# EAGLE design encoder_amplifier2_1layer (EAGLE 7.6.0)
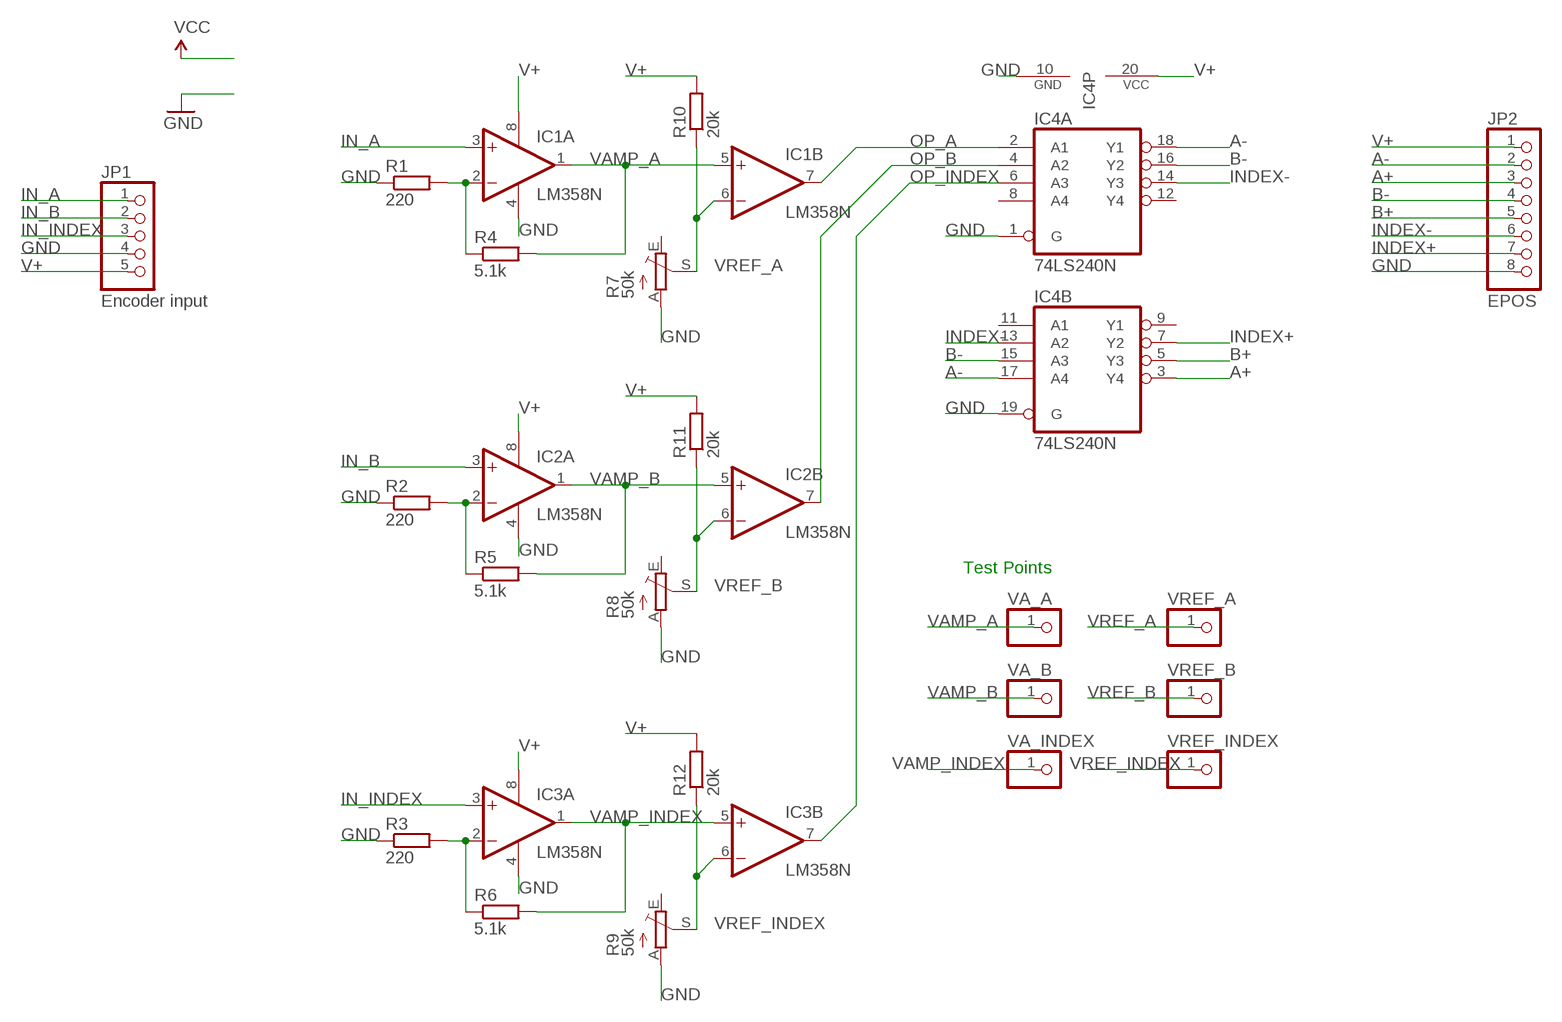
[diagram p0: schematic, sheet 1]

## Parts
IC1  LM358N  [DIL08]
IC2  LM358N  [DIL08]
IC3  LM358N  [DIL08]
IC4  74LS240N  [DIL20]
JP1  Encoder input  PINHD-1X5  [1X05]
JP2  EPOS  PINHD-1X8  [1X08]
R1  220  R-EU_0204/7  [0204/7]
R2  220  R-EU_0204/7  [0204/7]
R3  220  R-EU_0204/7  [0204/7]
R4  5.1k  R-EU_0204/7  [0204/7]
R5  5.1k  R-EU_0204/7  [0204/7]
R6  5.1k  R-EU_0204/7  [0204/7]
R7  50k  TRIM_EU-LI15  [LI15]
R8  50k  TRIM_EU-LI15  [LI15]
R9  50k  TRIM_EU-LI15  [LI15]
R10  20k  R-EU_0204/7  [0204/7]
R11  20k  R-EU_0204/7  [0204/7]
R12  20k  R-EU_0204/7  [0204/7]
VA_A  PINHD-1X1  [1X01]
VA_B  PINHD-1X1  [1X01]
VA_INDEX  PINHD-1X1  [1X01]
VREF_A  PINHD-1X1  [1X01]
VREF_B  PINHD-1X1  [1X01]
VREF_INDEX  PINHD-1X1  [1X01]

## Nets
A+: IC4.3(B:Y4) JP2.3
A-: IC4.17(B:A4) IC4.18(A:Y1) JP2.2
B+: IC4.5(B:Y3) JP2.5
B-: IC4.15(B:A3) IC4.16(A:Y2) JP2.4
GND: IC1.4(P:V-) IC2.4(P:V-) IC3.4(P:V-) IC4.1(A:G) IC4.10(P:GND) IC4.19(B:G) JP1.4 JP2.8 R1.1 R2.1 R3.1 R7.A R8.A R9.A
IN_A: IC1.3(A:+IN) JP1.1
IN_B: IC2.3(A:+IN) JP1.2
IN_INDEX: IC3.3(A:+IN) JP1.3
INDEX+: IC4.7(B:Y2) JP2.7
INDEX-: IC4.13(B:A2) IC4.14(A:Y3) JP2.6
N$1: IC1.2(A:-IN) R1.2 R4.1
N$2: IC2.2(A:-IN) R2.2 R5.1
N$3: IC3.2(A:-IN) R3.2 R6.1
OP_A: IC1.7(B:OUT) IC4.2(A:A1)
OP_B: IC2.7(B:OUT) IC4.4(A:A2)
OP_INDEX: IC3.7(B:OUT) IC4.6(A:A3)
V+: IC1.8(P:V+) IC2.8(P:V+) IC3.8(P:V+) IC4.20(P:VCC) JP1.5 JP2.1 R10.2 R11.2 R12.2 ; supply symbol labelled VCC
VAMP_A: IC1.1(A:OUT) IC1.5(B:+IN) R4.2 VA_A.1
VAMP_B: IC2.1(A:OUT) IC2.5(B:+IN) R5.2 VA_B.1
VAMP_INDEX: IC3.1(A:OUT) IC3.5(B:+IN) R6.2 VA_INDEX.1
VREF_A: IC1.6(B:-IN) R7.S R10.1 VREF_A.1
VREF_B: IC2.6(B:-IN) R8.S R11.1 VREF_B.1
VREF_INDEX: IC3.6(B:-IN) R9.S R12.1 VREF_INDEX.1
Unconnected: IC4.8(A:A4) IC4.9(B:Y1) IC4.11(B:A1) IC4.12(A:Y4) R7.E R8.E R9.E

## Notes on the sheet
- Test Points

## Library data of the parts
IC1-IC3 = linear:LM358: OP AMP also LM158; LM258; LM2904 Source: http://cache.national.com/ds/LM/LM158.pdf
IC4 = 74xx-us:74*240: Octal BUFFER and LINE DRIVER, 3-state
JP1 = pinhead:PINHD-1X5: PIN HEADER
JP2 = pinhead:PINHD-1X8: PIN HEADER
R1-R6 R10-R12 = resistor:R-EU_: RESISTOR, European symbol
R7-R9 = pot:TRIM_EU-: POTENTIOMETER
VA_A VA_B VA_INDEX VREF_A VREF_B VREF_INDEX = pinhead:PINHD-1X1: PIN HEADER

## Net classes
0 default: width 0.61 mm, drill 0.61 mm, clearance 0.61 mm

## Board
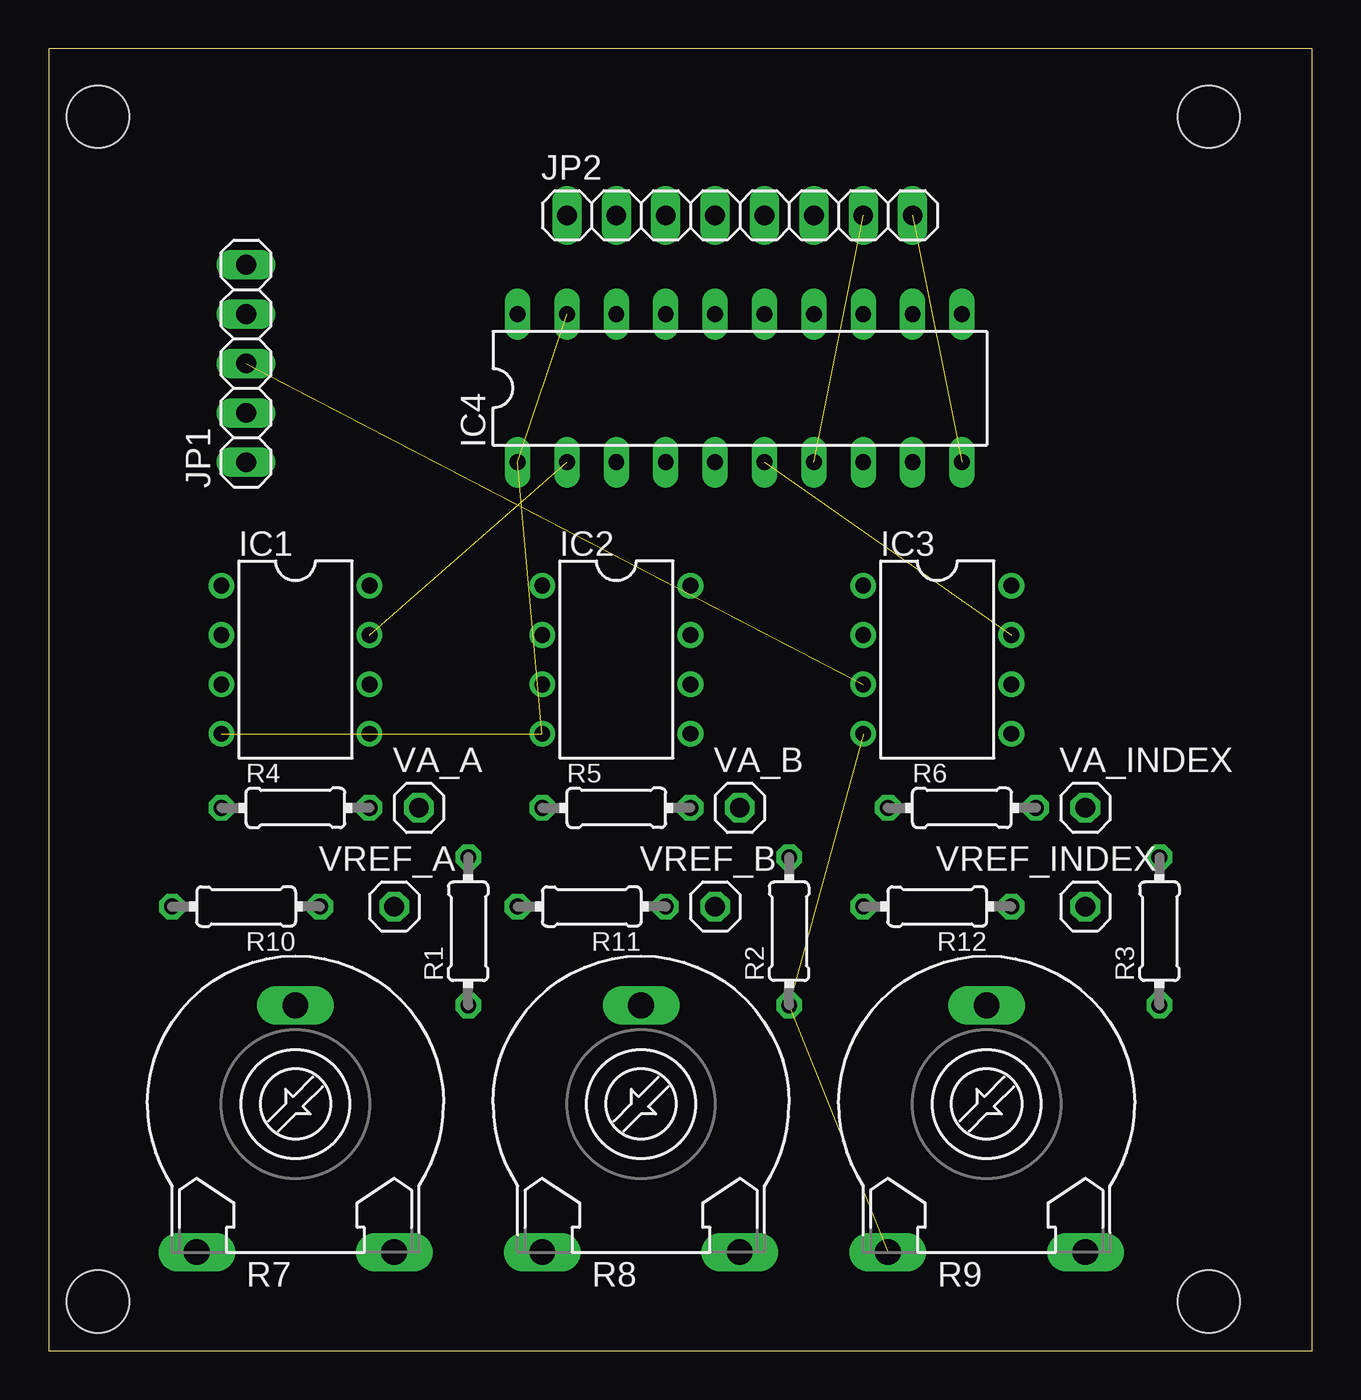
[diagram p1: board, top side]
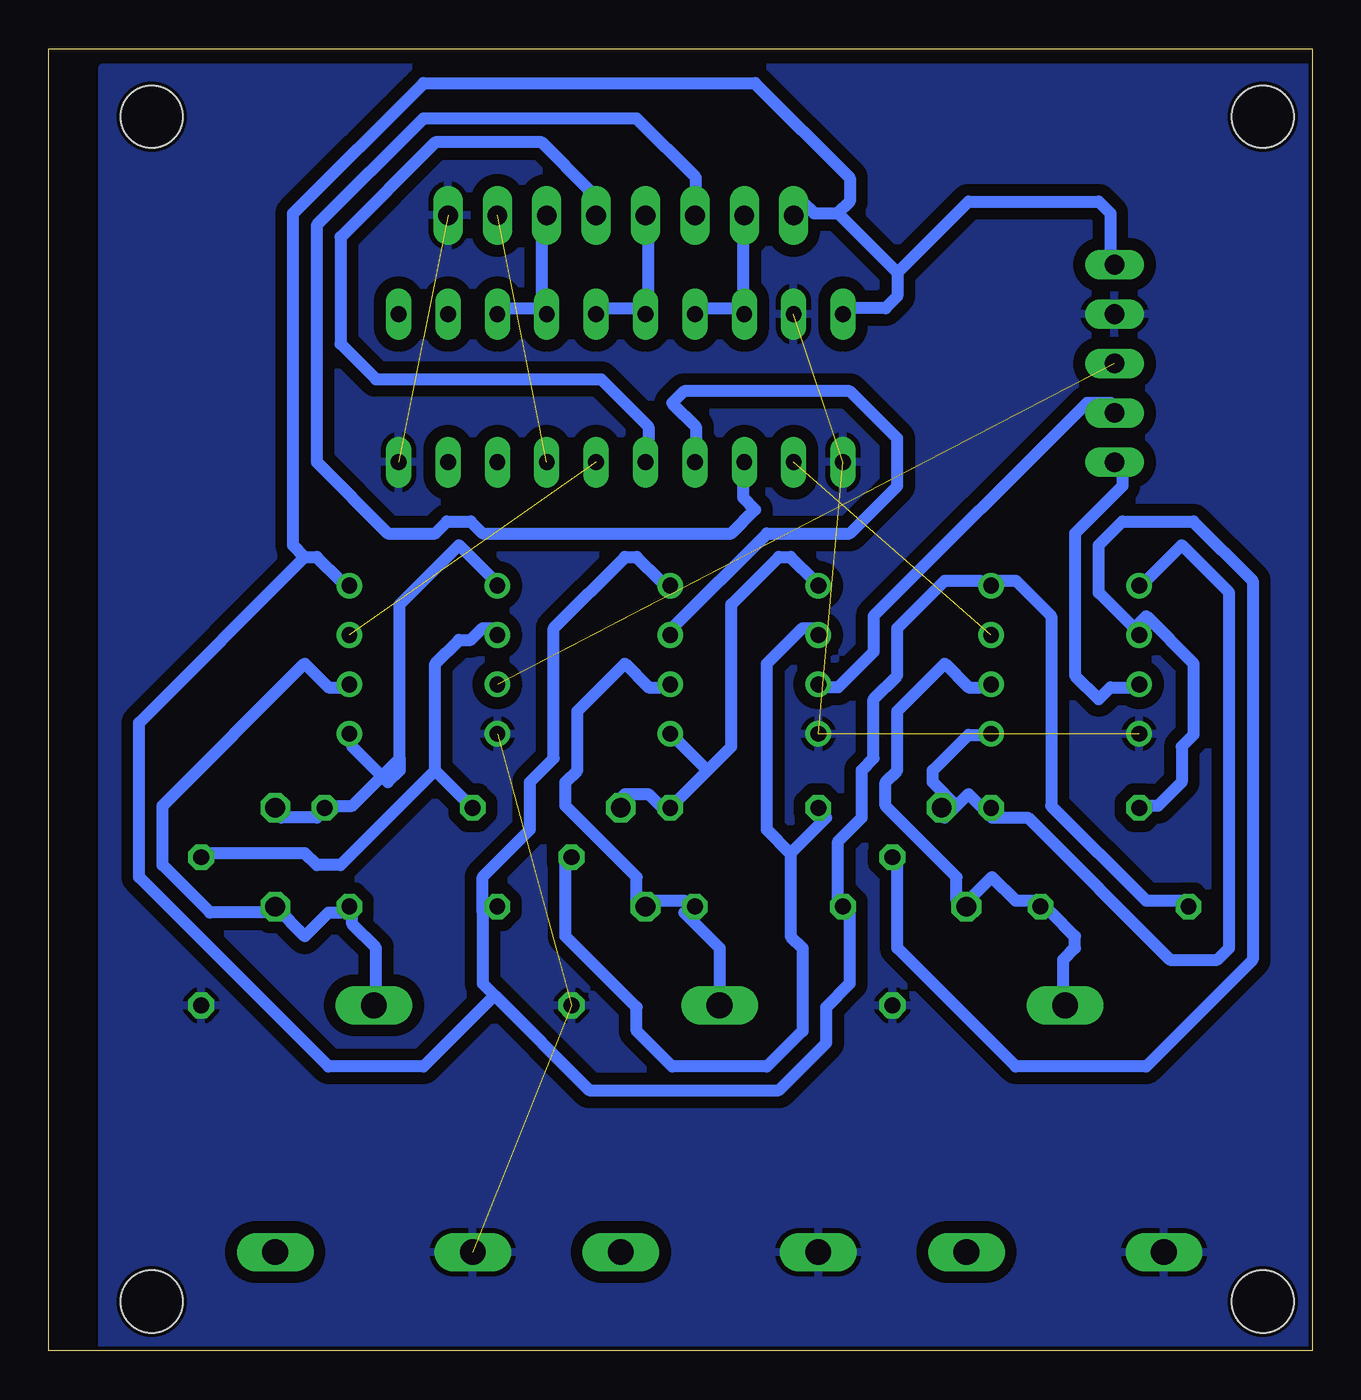
[diagram p2: board, bottom side, seen from below]

Size 65 x 67 mm. Coordinates in mm from the lower left corner, seen from the top.
Outline: 0,0 65,0 65,67 0,67 0,0
Copper layers (1*16): Top 0.035mm / dielectric 1.5mm / Bottom 0.035mm
Design rules "SparkFun-2-layer-STANDARD": minimum track width 10mil, minimum drill 20mil, track to track 10mil, track to pad 8mil, pad to pad 8mil, via to via 10mil, smd to smd 8mil, copper to edge 8mil, drill to drill 8mil, minimum pad ring 10mil, minimum via ring 10mil, stop-mask expansion 4mil, vias tented up to drill 25mil, thermal gap 10mil
Holes 3.2 mm at 2.54,63.5 59.69,63.5 59.69,2.54 2.54,2.54

### Footprints (pad centres in the part's own frame; a part is rotated, then mirrored left to right if it is on the bottom)
DIL08 = drill 0.813 pad 1.27: 1 -3.81,-3.81; 2 -1.27,-3.81; 3 1.27,-3.81; 4 3.81,-3.81; 5 3.81,3.81; 6 1.27,3.81; 7 -1.27,3.81; 8 -3.81,3.81
DIL20 = drill 0.813 long: 1 -11.43,-3.81; 2 -8.89,-3.81; 3 -6.35,-3.81; 4 -3.81,-3.81; 5 -1.27,-3.81; 6 1.27,-3.81; 7 3.81,-3.81; 8 6.35,-3.81; 9 8.89,-3.81; 10 11.43,-3.81; 11 11.43,3.81; 12 8.89,3.81; 13 6.35,3.81; 14 3.81,3.81; 15 1.27,3.81; 16 -1.27,3.81; 17 -3.81,3.81; 18 -6.35,3.81; 19 -8.89,3.81; 20 -11.43,3.81
1X05 = drill 1.016 long: 1 -5.08,0; 2 -2.54,0; 3 0,0; 4 2.54,0; 5 5.08,0
1X08 = drill 1.016 long: 1 -8.89,0; 2 -6.35,0; 3 -3.81,0; 4 -1.27,0; 5 1.27,0; 6 3.81,0; 7 6.35,0; 8 8.89,0
0204/7 = drill 0.813 octagon: 1 -3.81,0; 2 3.81,0
LI15 = drill 1.321 long: A -5.08,-7.62; E 5.08,-7.62; S 0,5.08
1X01 = drill 1.016 octagon: 1 0,0

### Placement (x,y rotation side)
IC1  12.7,35.56 270 top
IC2  29.21,35.56 270 top
IC3  45.72,35.56 270 top
IC4  35.56,49.53 0 top
JP1  10.16,50.8 90 top
JP2  35.56,58.42 0 top
R1  21.59,21.59 90 top
R2  38.1,21.59 90 top
R3  57.15,21.59 90 top
R4  12.7,27.94 0 top
R5  29.21,27.94 0 top
R6  46.99,27.94 0 top
R7  12.7,12.7 0 top
R8  30.48,12.7 0 top
R9  48.26,12.7 0 top
R10  10.16,22.86 180 top
R11  27.94,22.86 180 top
R12  45.72,22.86 180 top
VA_A  19.05,27.94 0 top
VA_B  35.56,27.94 0 top
VA_INDEX  53.34,27.94 0 top
VREF_A  17.78,22.86 0 top
VREF_B  34.29,22.86 0 top
VREF_INDEX  53.34,22.86 0 top

### Tracks (layer width: path | path; a pad name or v marks a point on that pad's centre or on a via)
A+
  Bottom 0.61: IC4.3 29.26,45.72 29.26,43.89 28.65,43.28 29.87,42.06 42.67,42.06 43.28,42.67 44.5,42.67 45.11,42.06 47.55,42.06 51.21,45.72 51.21,57.91 45.72,63.4 34.75,63.4 31.7,60.35 31.7,58.52 JP2.3
A-
  Bottom 0.61: 29.26,53.65 31.7,53.65 IC4.17 | 29.26,53.65 29.26,57.91 JP2.2 | 29.26,53.65 IC4.18
B+
  Bottom 0.61: IC4.5 34.14,45.72 34.14,47.55 36.58,49.99 48.16,49.99 49.99,51.82 49.99,57.3 45.11,62.18 39.62,62.18 37.19,59.74 37.19,58.52 JP2.5
B-
  Bottom 0.61: IC4.15 36.58,53.65 34.75,53.65 IC4.16 34.14,53.65 34.14,57.91 JP2.4
GND  (6 unrouted)
  pour Bottom: 0,0 62.23,0 62.23,3.81 62.23,66.04 0,66.04
IN_A
  Bottom 0.61: IC1.3 9.14,34.14 10.36,34.14 10.97,33.53 12.19,34.75 12.19,42.06 9.75,44.5 9.75,45.72 JP1.1
IN_B
  Bottom 0.61: IC2.3 24.99,34.14 24.38,34.14 22.55,35.97 22.55,37.8 11.58,48.77 10.36,48.77 JP1.2
IN_INDEX  (1 unrouted)
INDEX+  (1 unrouted)
INDEX-
  Bottom 0.61: 39.62,53.65 41.45,53.65 IC4.13 | 39.62,53.65 39.62,57.91 JP2.6 | 39.62,53.65 IC4.14
N$1
  Bottom 0.61: 9.14,37.19 8.53,37.8 6.1,35.36 6.1,31.7 6.71,31.09 6.71,29.26 7.92,28.04 8.53,28.04 R4.1 | 9.14,37.19 10.97,39.01 10.97,41.45 9.75,42.67 6.1,42.67 3.05,39.62 3.05,20.12 8.53,14.63 15.24,14.63 21.34,20.73 21.34,24.99 R1.2 | 9.14,37.19 IC1.2
N$2
  Bottom 0.61: 26.82,25.6 26.82,21.34 26.21,20.73 26.21,16.46 28.04,14.63 32.92,14.63 34.75,16.46 34.75,17.68 38.41,21.34 38.41,24.99 R2.2 | 26.82,25.6 24.99,27.43 R5.1 | 26.82,25.6 28.04,26.82 28.04,35.36 26.21,37.19 25.6,37.19 IC2.2
N$3
  Bottom 0.61: 45.11,29.87 45.11,35.36 43.89,36.58 43.28,36.58 42.67,37.19 42.06,37.19 IC3.2 | R6.1 45.11,29.87 | 45.11,29.87 49.99,24.99 51.21,24.99 51.82,25.6 56.69,25.6 R3.2
OP_A  (1 unrouted)
OP_B
  Bottom 0.61: IC4.4 31.7,45.72 31.7,47.55 32.92,48.77 32.31,49.38 23.77,49.38 21.34,46.94 21.34,44.5 23.77,42.06 28.04,42.06 32.92,37.19 IC2.7
OP_INDEX  (1 unrouted)
V+
  Bottom 0.61: R10.2 6.71,23.16 8.53,23.16 13.41,28.04 13.41,37.8 15.24,39.62 16.46,39.62 IC1.8 17.07,39.62 18.9,39.62 21.34,37.19 21.34,34.75 22.55,33.53 22.55,30.48 23.16,29.87 23.16,27.43 24.38,26.21 24.38,23.16 R11.2 23.77,22.55 23.77,18.9 24.99,17.68 24.99,15.85 27.43,13.41 37.19,13.41 42.06,18.29 | 21.34,55.47 21.34,54.25 21.95,53.65 23.77,53.65 IC4.20 | 24.38,58.52 21.34,55.47 | 24.38,58.52 25.6,58.52 26.21,59.13 26.82,58.52 JP2.1 | 21.34,55.47 17.68,59.13 10.97,59.13 10.36,58.52 10.36,56.08 JP1.5 | 42.06,18.29 42.67,18.9 42.67,22.55 | 42.67,22.55 42.06,23.16 R12.2 | 42.67,22.55 42.67,24.38 40.23,26.82 40.23,29.26 39.01,30.48 39.01,37.19 35.36,40.84 34.75,40.84 33.53,39.62 IC2.8 | 51.82,40.84 51.21,40.84 49.99,39.62 IC3.8 | 51.82,40.84 60.35,32.31 60.35,24.38 50.6,14.63 45.72,14.63 42.06,18.29 | 24.38,58.52 23.77,59.13 23.77,60.35 28.65,65.23 45.72,65.23 52.43,58.52 52.43,41.45 51.82,40.84
VAMP_A
  Bottom 0.61: 18.29,28.04 18.9,27.43 VA_A.1 | 18.29,28.04 17.68,28.65 17.07,28.04 R4.2 16.46,27.43 14.63,27.43 7.32,20.12 4.88,20.12 4.27,20.73 4.27,39.01 6.71,41.45 8.53,39.62 IC1.1 | 18.29,28.04 19.51,29.26 19.51,29.87 17.68,31.7 17.07,31.7 IC1.5
VAMP_B
  Bottom 0.61: VA_B.1 35.97,28.04 35.36,28.65 34.14,28.65 33.53,28.04 R5.2 31.09,29.87 | 31.09,29.87 32.92,31.7 IC2.5 | 31.09,29.87 29.87,31.09 29.87,38.41 27.43,40.84 26.82,40.84 25.6,39.62 IC2.1
VAMP_INDEX
  Bottom 0.61: 46.94,30.48 46.94,38.41 43.89,41.45 42.06,39.62 IC3.1 | 46.94,30.48 49.38,28.04 50.6,28.04 R6.2 51.21,27.43 53.03,27.43 VA_INDEX.1 | 46.94,30.48 46.94,29.87 47.55,29.26 49.38,31.09 49.38,31.7 IC3.5
VREF_A
  Bottom 0.61: R7.S 12.8,18.29 12.8,20.12 12.19,20.73 12.19,21.34 13.41,22.55 R10.1 14.02,23.16 15.24,23.16 16.46,24.38 17.68,23.16 VREF_A.1 18.29,23.16 18.29,24.38 21.95,28.04 21.95,29.26 21.34,29.87 21.34,32.92 18.9,35.36 17.68,34.14 17.07,34.14 IC1.6
VREF_B
  Bottom 0.61: IC2.6 33.53,34.14 34.14,34.14 35.36,35.36 37.8,32.92 37.8,29.87 38.41,29.26 38.41,28.04 34.75,24.38 34.75,23.16 VREF_B.1 34.14,23.16 32.31,23.16 R11.1 32.31,22.55 30.48,20.73 R8.S
VREF_INDEX
  Bottom 0.61: R9.S 48.16,18.29 48.16,20.73 49.38,21.95 49.38,22.55 R12.1 49.99,22.55 50.6,22.55 51.82,21.34 VREF_INDEX.1 53.65,22.55 56.69,22.55 59.13,24.99 59.13,28.04 51.82,35.36 50.6,34.14 49.99,34.14 IC3.6

### Text on the board
tValues: V+ A- A B- B IND- IND G | A B IND G V+